# EAGLE design BOTTOM_pcb_redonda_definitiva (EAGLE 9.6.2)
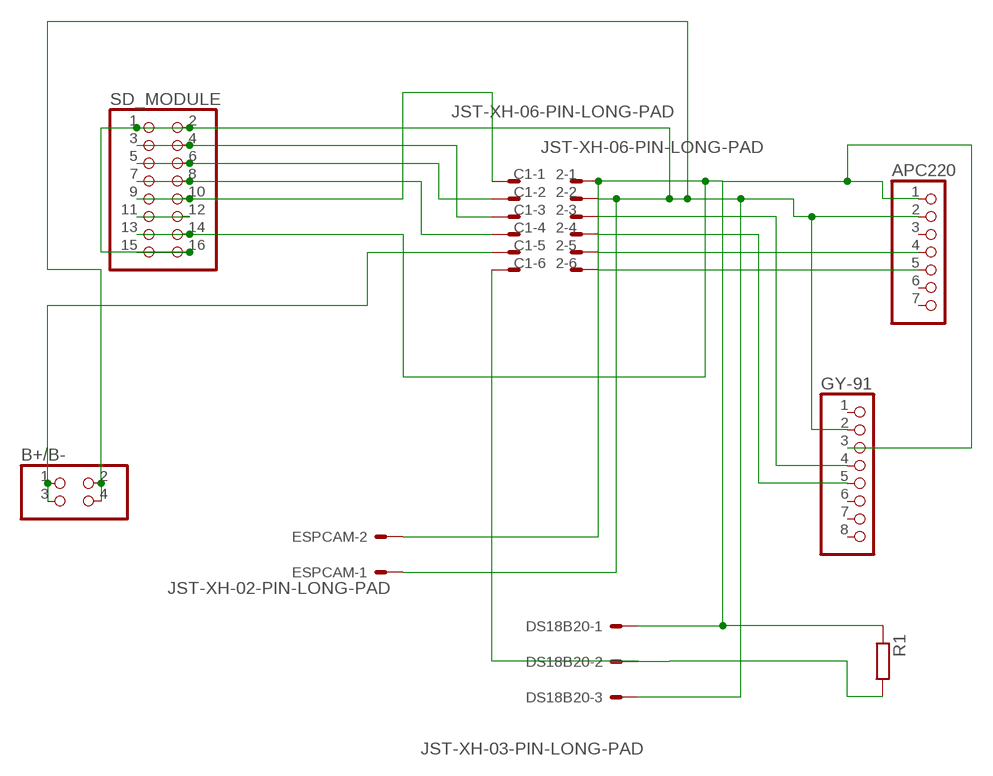
[diagram p0: schematic, sheet 1]

## Parts
2  JST-XH-06-PIN-LONG-PAD  [JST-XH-06-PACKAGE-LONG-PAD]
APC220  PINHD-1X7  [1X07]
B+/B-  PINHD-2X2  [2X02]
C1  JST-XH-06-PIN-LONG-PAD  [JST-XH-06-PACKAGE-LONG-PAD]
DS18B20  JST-XH-03-PIN-LONG-PAD  [JST-XH-03-PACKAGE-LONG-PAD]
ESPCAM  JST-XH-02-PIN-LONG-PAD  [JST-XH-02-PACKAGE-LONG-PAD]
GY-91  PINHD-1X8  [1X08]
R1  R-EU_0207/10  [0207/10]
SD_MODULE  PINHD-2X8  [2X08]

## Nets
N$1: B+/B-.1 B+/B-.3 C1.5
N$2: 2.2 APC220.2 B+/B-.2 B+/B-.4 DS18B20.3 ESPCAM.1 GY-91.2 SD_MODULE.1 SD_MODULE.2 SD_MODULE.15 SD_MODULE.16
N$3: 2.5 APC220.4
N$4: 2.6 APC220.5
N$5: 2.3 GY-91.4
N$6: 2.4 GY-91.5
N$8: C1.6 DS18B20.2 R1.2
N$9: C1.3 SD_MODULE.3 SD_MODULE.4
N$10: C1.2 SD_MODULE.5 SD_MODULE.6
N$11: C1.4 SD_MODULE.7 SD_MODULE.8
N$12: C1.1 SD_MODULE.9 SD_MODULE.10
N$13: SD_MODULE.11 SD_MODULE.12
N$14: 2.1 APC220.1 DS18B20.1 ESPCAM.2 GY-91.3 R1.1 SD_MODULE.13 SD_MODULE.14
Unconnected: APC220.3 APC220.6 APC220.7 GY-91.1 GY-91.6 GY-91.7 GY-91.8

## Library data of the parts
2 C1 = Rembrandt Electronics - JST XH Connectors v1-0:JST-XH-06-PIN: JST XH Connector 2 Pin Wire to board connector. Pitch: 2,54 mm, (0.100") Number of pins: 6 Created by Rembrandt Electronics www.rembrandtelectronics.com
APC220 = pinhead:PINHD-1X7: PIN HEADER
B+/B- = pinhead:PINHD-2X2: PIN HEADER
DS18B20 = Rembrandt Electronics - JST XH Connectors v1-0:JST-XH-03-PIN: JST XH Connector 2 Pin Wire to board connector. Pitch: 2,54 mm, (0.100") Number of pins: 3 Created by Rembrandt Electronics www.rembrandtelectronics.com
ESPCAM = Rembrandt Electronics - JST XH Connectors v1-0:JST-XH-02-PIN: JST XH Connector 2 Pin Wire to board connector. Pitch: 2,54 mm, (0.100") Number of pins: 2 Created by Rembrandt Electronics www.rembrandtelectronics.com
GY-91 = pinhead:PINHD-1X8: PIN HEADER
R1 = rcl:R-EU_: RESISTOR, European symbol; SPICEPREFIX: R
SD_MODULE = pinhead:PINHD-2X8: PIN HEADER

## Board
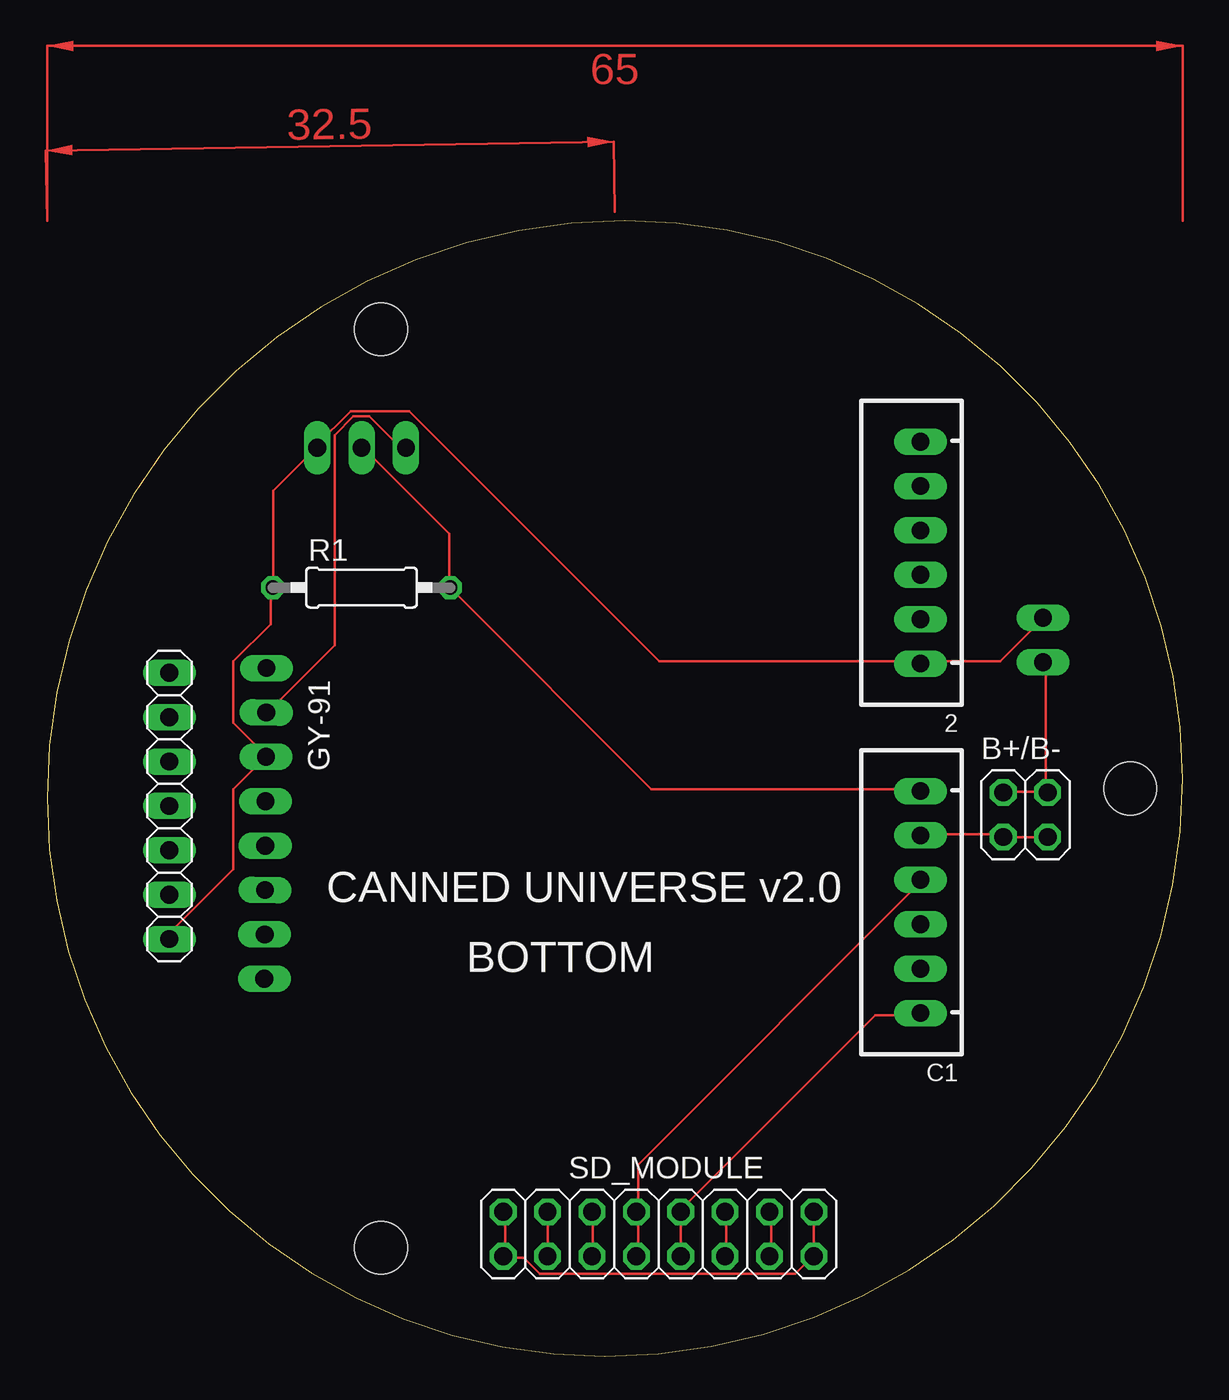
[diagram p1: board, top side]
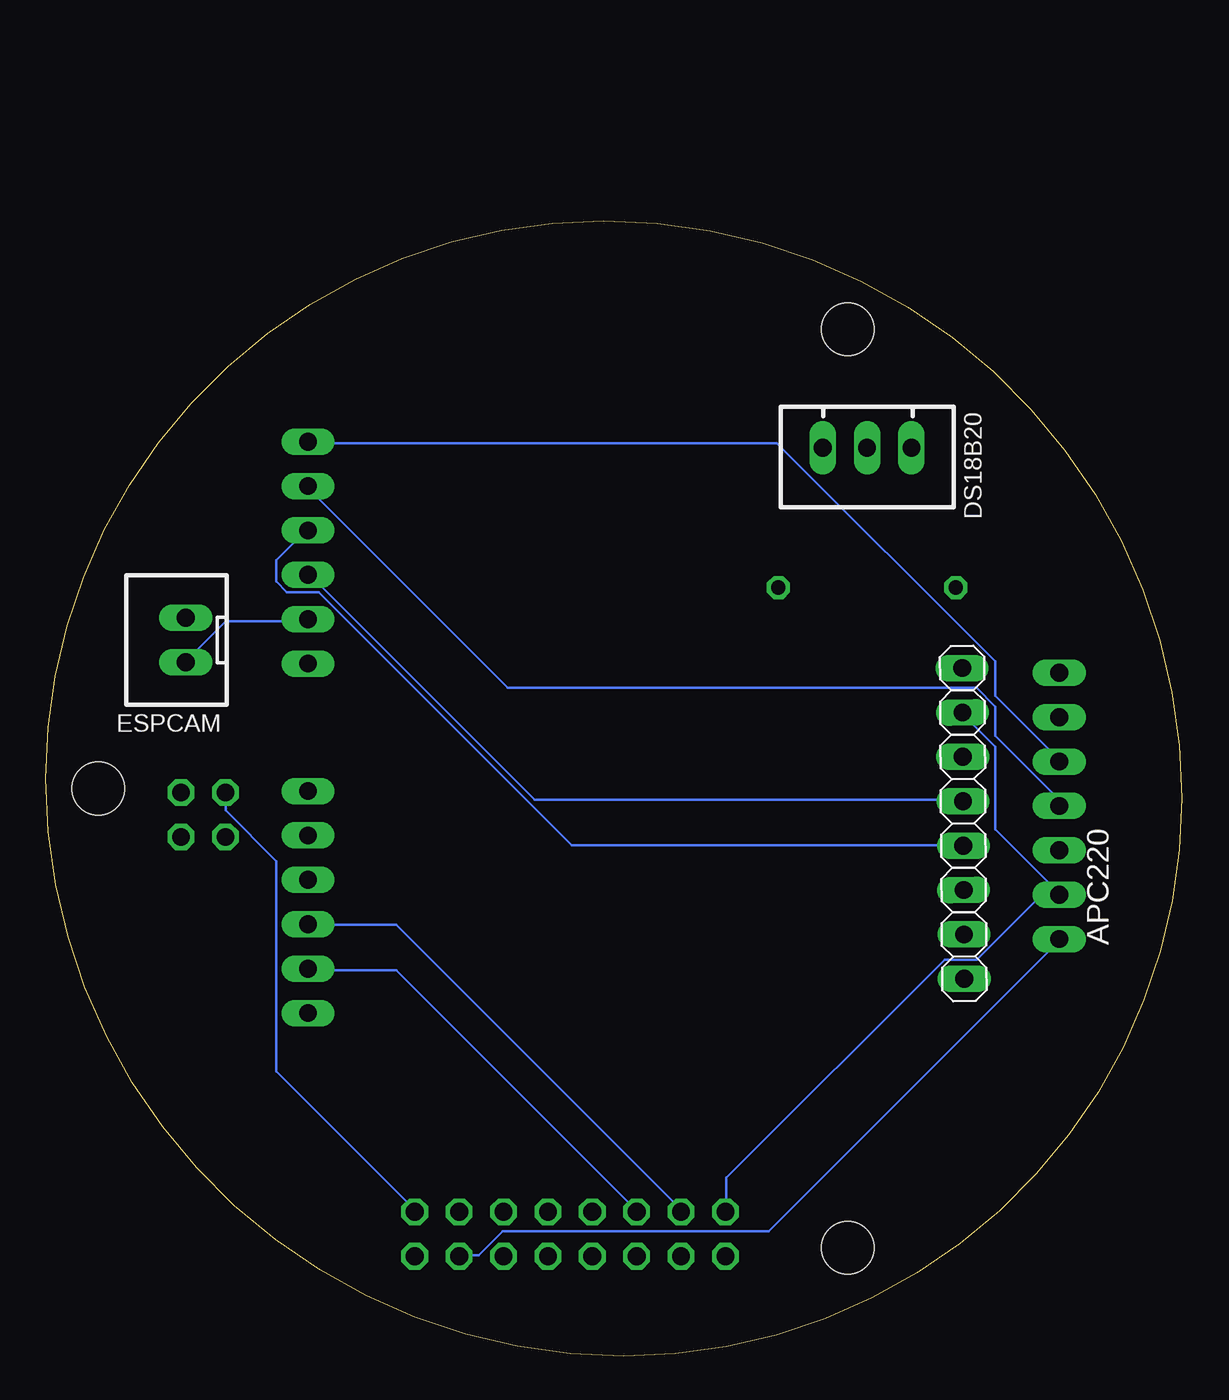
[diagram p2: board, bottom side, seen from below]

Size 65 x 65 mm. Coordinates in mm from the lower left corner, seen from the top.
Outline: 0,31.93 arc90 31.93,0 arc90 65,33.06 arc90 33.06,65 arc90 0,31.93
Copper layers (1*16): Top 0.035mm / dielectric 1.5mm / Bottom 0.035mm
Design rules "default": minimum track width 6mil, minimum drill 0.35mm, track to track 6mil, track to pad 6mil, pad to pad 6mil, via to via 6mil, smd to smd 6mil, copper to edge 40mil, drill to drill 6mil, minimum pad ring 10mil, minimum via ring 8mil, stop-mask expansion 4mil, vias tented up to drill 0mil, thermal gap 10mil
Holes 3 mm at 62,32.5 19.11,58.79 19.11,6.21

### Footprints (pad centres in the part's own frame; a part is rotated, then mirrored left to right if it is on the bottom)
JST-XH-06-PACKAGE-LONG-PAD = drill 1.016 long: 1 -6.35,0; 2 -3.81,0; 3 -1.27,0; 4 1.27,0; 5 3.81,0; 6 6.35,0
1X07 = drill 1.016 long: 1 -7.62,0; 2 -5.08,0; 3 -2.54,0; 4 0,0; 5 2.54,0; 6 5.08,0; 7 7.62,0
2X02 = drill 1.016 octagon: 1 -1.27,-1.27; 2 -1.27,1.27; 3 1.27,-1.27; 4 1.27,1.27
JST-XH-03-PACKAGE-LONG-PAD = drill 1.016 long: 1 -2.54,0; 2 0,0; 3 2.54,0
JST-XH-02-PACKAGE-LONG-PAD = drill 1.016 long: 1 -1.27,0; 2 1.27,0
1X08 = drill 1.016 long: 1 -8.89,0; 2 -6.35,0; 3 -3.81,0; 4 -1.27,0; 5 1.27,0; 6 3.81,0; 7 6.35,0; 8 8.89,0
0207/10 = drill 0.813 octagon: 1 -5.08,0; 2 5.08,0
2X08 = drill 1.016 octagon: 1 -8.89,-1.27; 2 -8.89,1.27; 3 -6.35,-1.27; 4 -6.35,1.27; 5 -3.81,-1.27; 6 -3.81,1.27; 7 -1.27,-1.27; 8 -1.27,1.27; 9 1.27,-1.27; 10 1.27,1.27; 11 3.81,-1.27; 12 3.81,1.27; 13 6.35,-1.27; 14 6.35,1.27; 15 8.89,-1.27; 16 8.89,1.27

### Placement (x,y rotation side)
2  50,46 90 top
APC220  7,31.5 90 top
B+/B-  56,31 0 top
C1  50,26 90 top
DS18B20  18,52 180 bottom
ESPCAM  57,41 90 bottom
GY-91  12.5,30.5 270.4 bottom
R1  18,44 0 top
SD_MODULE  35,7 0 top

### Tracks (layer width: path | path; a pad name or v marks a point on that pad's centre or on a via)
N$1
  Top 0.152: B+/B-.3 57.15,29.72 54.86,29.72 B+/B-.1 54.71,29.87 50.14,29.87 C1.5
N$2
  Top 0.152: DS18B20.3 20.42,52.12 20.12,52.12 18.44,53.8 17.53,53.8 16.46,52.73 16.46,40.69 12.65,36.88 GY-91.2 | 57.15,32.31 54.86,32.31 B+/B-.2 | 57.15,32.31 57.15,39.62 ESPCAM.1 | 57.15,32.31 B+/B-.4 | SD_MODULE.2 26.21,8.23 26.21,5.79 SD_MODULE.1 26.21,5.64 27.28,5.64 28.19,4.72 42.82,4.72 43.74,5.64 SD_MODULE.15 43.89,5.79 43.89,8.23 SD_MODULE.16
  Bottom 0.152: 7.47,26.98 10.67,30.18 10.67,34.9 12.5,36.73 GY-91.2 | 7.47,26.98 7.01,26.52 APC220.2 7.47,26.98 | 2.2 50.14,42.06 54.71,42.06 57,39.78 ESPCAM.1 | B+/B-.2 54.71,32.16 54.71,31.24 51.82,28.35 51.82,16.31 43.89,8.38 SD_MODULE.16 | 7.47,26.98 11.73,22.71 13.56,22.71 26.06,10.21 26.06,8.38 SD_MODULE.2
N$3
  Bottom 0.152: APC220.4 7.01,31.55 7.01,31.85 10.67,35.51 10.67,37.19 11.73,38.25 38.56,38.25 49.99,49.68 2.5
N$4
  Bottom 0.152: APC220.5 7.01,34.14 10.67,37.8 10.67,39.78 23.16,52.27 49.99,52.27 2.6
N$5
  Bottom 0.152: GY-91.4 12.65,31.85 37.03,31.85 49.99,44.81 2.3
N$6
  Bottom 0.152: GY-91.5 12.5,29.26 34.9,29.26 49.38,43.74 51.21,43.74 51.82,44.35 51.82,45.57 50.14,47.24 2.4
N$8
  Top 0.152: DS18B20.2 18.14,51.97 23.01,47.09 23.01,44.04 R1.2 23.16,43.89 34.59,32.46 49.99,32.46 C1.6
N$9
  Top 0.152: SD_MODULE.3 28.65,5.79 28.65,8.23 SD_MODULE.4
  Bottom 0.152: C1.3 49.99,24.69 44.96,24.69 28.65,8.38 SD_MODULE.4
N$10
  Top 0.152: SD_MODULE.5 31.24,5.79 31.24,8.23 SD_MODULE.6
  Bottom 0.152: C1.2 49.99,22.1 44.96,22.1 31.24,8.38 SD_MODULE.6
N$11
  Top 0.152: SD_MODULE.7 33.83,5.79 33.83,8.23 SD_MODULE.8 33.83,8.38 33.83,10.97 49.99,27.13 C1.4
N$12
  Top 0.152: SD_MODULE.9 36.27,5.79 36.27,8.23 SD_MODULE.10 36.27,8.38 47.4,19.51 49.99,19.51 C1.1
N$13
  Top 0.152: SD_MODULE.11 38.86,5.79 38.86,8.23 SD_MODULE.12
N$14
  Top 0.152: ESPCAM.2 57,42.22 54.56,39.78 50.14,39.78 2.1 49.99,39.78 35.05,39.78 20.73,54.1 17.37,54.1 15.39,52.12 DS18B20.1 15.39,51.97 12.95,49.53 12.95,44.04 R1.1 12.8,43.89 12.8,41.91 10.67,39.78 10.67,36.27 12.5,34.44 GY-91.3 12.5,34.29 10.67,32.46 10.67,27.89 7.01,24.23 7.01,23.93 APC220.1 | SD_MODULE.13 41.45,5.79 41.45,8.23 SD_MODULE.14
  Bottom 0.152: SD_MODULE.13 41.3,5.79 40.23,5.79 38.86,7.16 23.62,7.16 7.01,23.77 APC220.1
(copper drawn outside any net)
  shapes: Top area x2

### Text on the board
tNames: CANNED UNIVERSE v2.0 | BOTTOM